# EAGLE design avrsmdprog (EAGLE 5.10)
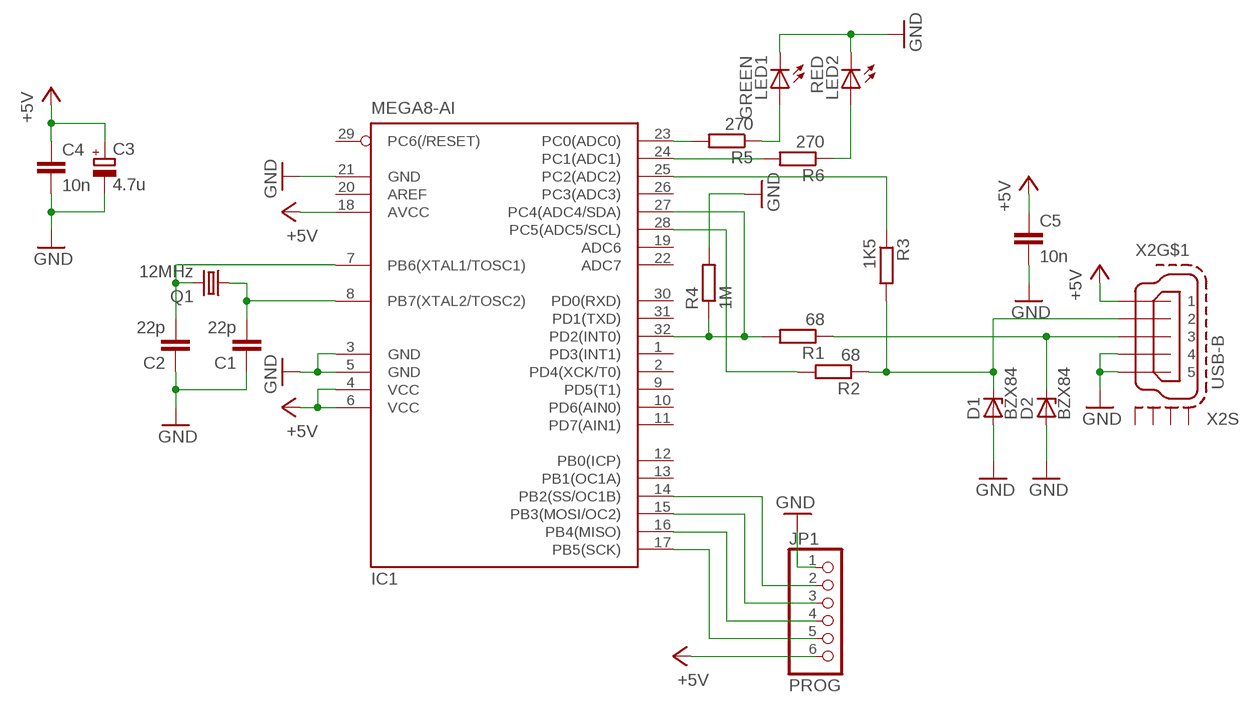
[diagram p0: schematic, sheet 1]

## Parts
C1  22p  C-EUC0805  [C0805]
C2  22p  C-EUC0805  [C0805]
C3  4.7u  CPOL-EU153CLV-0810  [153CLV-0810]
C4  10n  C-EUC0805  [C0805]
C5  10n  C-EUC0805  [C0805]
D1  BZX84  BZX84CSMD  [TO236]
D2  BZX84  BZX84CSMD  [TO236]
IC1  MEGA8-AI  [TQFP32-08]
JP1  PROG  PINHD-1X6/90  [1X06/90]
LED1  GREEN  LEDCHIPLED_0805  [CHIPLED_0805]
LED2  RED  LEDCHIPLED_0805  [CHIPLED_0805]
Q1  12MHz  CRYSTALHC49UP  [HC49UP]
R1  68  R-EU_R0805  [R0805]
R2  68  R-EU_R0805  [R0805]
R3  1K5  R-EU_R0805  [R0805]
R4  1M  R-EU_R0805  [R0805]
R5  270  R-EU_R0805  [R0805]
R6  270  R-EU_R0805  [R0805]
X2  USB-B  MINI-USB-SCHIELD-32005-201  [32005-201]

## Nets
+5V: C3.+ C4.1 C5.1 IC1.4(VCC) IC1.6(VCC) IC1.18(AVCC) JP1.6 X2.1
GND: C1.1 C2.1 C3.- C4.2 C5.2 D1.A D2.A IC1.3(GND) IC1.5(GND) IC1.21(GND) JP1.1 LED1.C LED2.C R4.2 X2.4 X2.5
N$1: C1.2 IC1.8(PB7(XTAL2/TOSC2)) Q1.1
N$2: D2.C R1.1 X2.3
N$3: D1.C R2.1 R3.2 X2.2
N$4: C2.2 IC1.7(PB6(XTAL1/TOSC1)) Q1.2
N$5: IC1.25(PC2(ADC2)) R3.1
N$6: LED2.A R6.1
N$7: IC1.23(PC0(ADC0)) R5.2
N$8: IC1.24(PC1(ADC1)) R6.2
N$9: LED1.A R5.1
N$10: IC1.14(PB2(SS/OC1B)) JP1.2
N$11: IC1.15(PB3(MOSI/OC2)) JP1.3
N$12: IC1.16(PB4(MISO)) JP1.4
N$13: IC1.17(PB5(SCK)) JP1.5
N$14: IC1.28(PC5(ADC5/SCL)) R2.2
N$15: IC1.27(PC4(ADC4/SDA)) IC1.32(PD2(INT0)) R1.2 R4.1
Unconnected: IC1.1(PD3(INT1)) IC1.2(PD4(XCK/T0)) IC1.9(PD5(T1)) IC1.10(PD6(AIN0)) IC1.11(PD7(AIN1)) IC1.12(PB0(ICP)) IC1.13(PB1(OC1A)) IC1.19(ADC6) IC1.20(AREF) IC1.22(ADC7) IC1.26(PC3(ADC3)) IC1.29(PC6(/RESET)) IC1.30(PD0(RXD)) IC1.31(PD1(TXD)) X2.M1(S:S1) X2.M2(S:S2) X2.M3(S:S3) X2.M4(S:S4)

## Library data of the parts
C1 C2 C4 C5 = rcl:C-EU: CAPACITOR, European symbol
C3 = rcl:CPOL-EU: POLARIZED CAPACITOR, European symbol
D1 D2 = diode:BZX84CSMD: Z DIODE
IC1 = atmel:MEGA8: MICROCONTROLLER 8 Kbytes FLASH, 1 kbytes SRAM, 512 bytes EEPROM, USART, 6-channel 10 bit ADC, 2-channel 8 bit ADC Pin compatible with Atmega48, ATMega88, ATMega168 Source: avr.lbr
JP1 = pinhead:PINHD-1X6: PIN HEADER
LED1 LED2 = led:LED: LED OSRAM: - CHIPLED LG R971, LG N971, LY N971, LG Q971, LY Q971, LO R971, LY R971 LH N974, LH R974 LS Q976, LO Q976, LY Q976 LO Q996 - Hyper CHIPLED LW Q18S LB Q993, LB Q99A, LB R99A - SideLED LS A670, LO A670, LY A670, LG A670, LP A670 LB A673, LV A673, LT A673, LW A673 LH A674 LY A675 LS A676, LA A676, LO A676, LY A676, LW A676 LS A679, LY A679, LG A679 - Hyper Micro SIDELED® LS Y876, LA Y876, LO Y876, LY Y876 LT Y87S - SmartLED LW L88C, LW L88S LB L89C, LB L89S, LG L890 LS L89K, LO L89K, LY L89K LS L896, LA L896, LO L896, LY L896 - TOPLED LS T670, LO T670, LY T670, LG T670, LP T670 LSG T670, LSP T670, LSY T670, LOP T670, LYG T670 LG T671, LOG T671, LSG T671 LB T673, LV T673, LT T673, LW T673 LH T674 LS T676, LA T676, LO T676, LY T676, LB T676, LH T676, LSB T676, LW T676 LB T67C, LV T67C, LT T67C, LS T67K, LO T67K, LY T67K, LW E67C LS E67B, LA E67B, LO E67B, LY E67B, LB E67C, LV E67C, LT E67C LW T67C LS T679, LY T679, LG T679 LS T770, LO T770, LY T770, LG T770, LP T770 LB T773, LV T773, LT T773, LW T773 LH T774 LS E675, LA E675, LY E675, LS T675 LS T776, LA T776, LO T776, LY T776, LB T776 LHGB T686 LT T68C, LB T68C - Hyper Mini TOPLED® LB M676 - Mini TOPLED Santana® LG M470 LS M47K, LO M47K, LY M47K Source: http://www.osram.convergy.de LUXEON: - LUMILED® LXK2-PW12-R00, LXK2-PW12-S00, LXK2-PW14-U00, LXK2-PW14-V00 LXK2-PM12-R00, LXK2-PM12-S00, LXK2-PM14-U00 LXK2-PE12-Q00, LXK2-PE12-R00, LXK2-PE12-S00, LXK2-PE14-T00, LXK2-PE14-U00 LXK2-PB12-K00, LXK2-PB12-L00, LXK2-PB12-M00, LXK2-PB14-N00, LXK2-PB14-P00, LXK2-PB14-Q00 LXK2-PR12-L00, LXK2-PR12-M00, LXK2-PR14-Q00, LXK2-PR14-R00 LXK2-PD12-Q00, LXK2-PD12-R00, LXK2-PD12-S00 LXK2-PH12-R00, LXK2-PH12-S00 LXK2-PL12-P00, LXK2-PL12-Q00, LXK2-PL12-R00 Source: www.luxeon.com KINGBRIGHT: KA-3528ASYC Source: www.kingbright.com
Q1 = crystal:CRYSTAL: CRYSTAL
R1-R6 = rcl:R-EU_: RESISTOR, European symbol
X2 = con-cypressindustries:MINI-USB-SCHIELD-: MINI USB-B Conector Source: www.cypressindustries.com

## Board
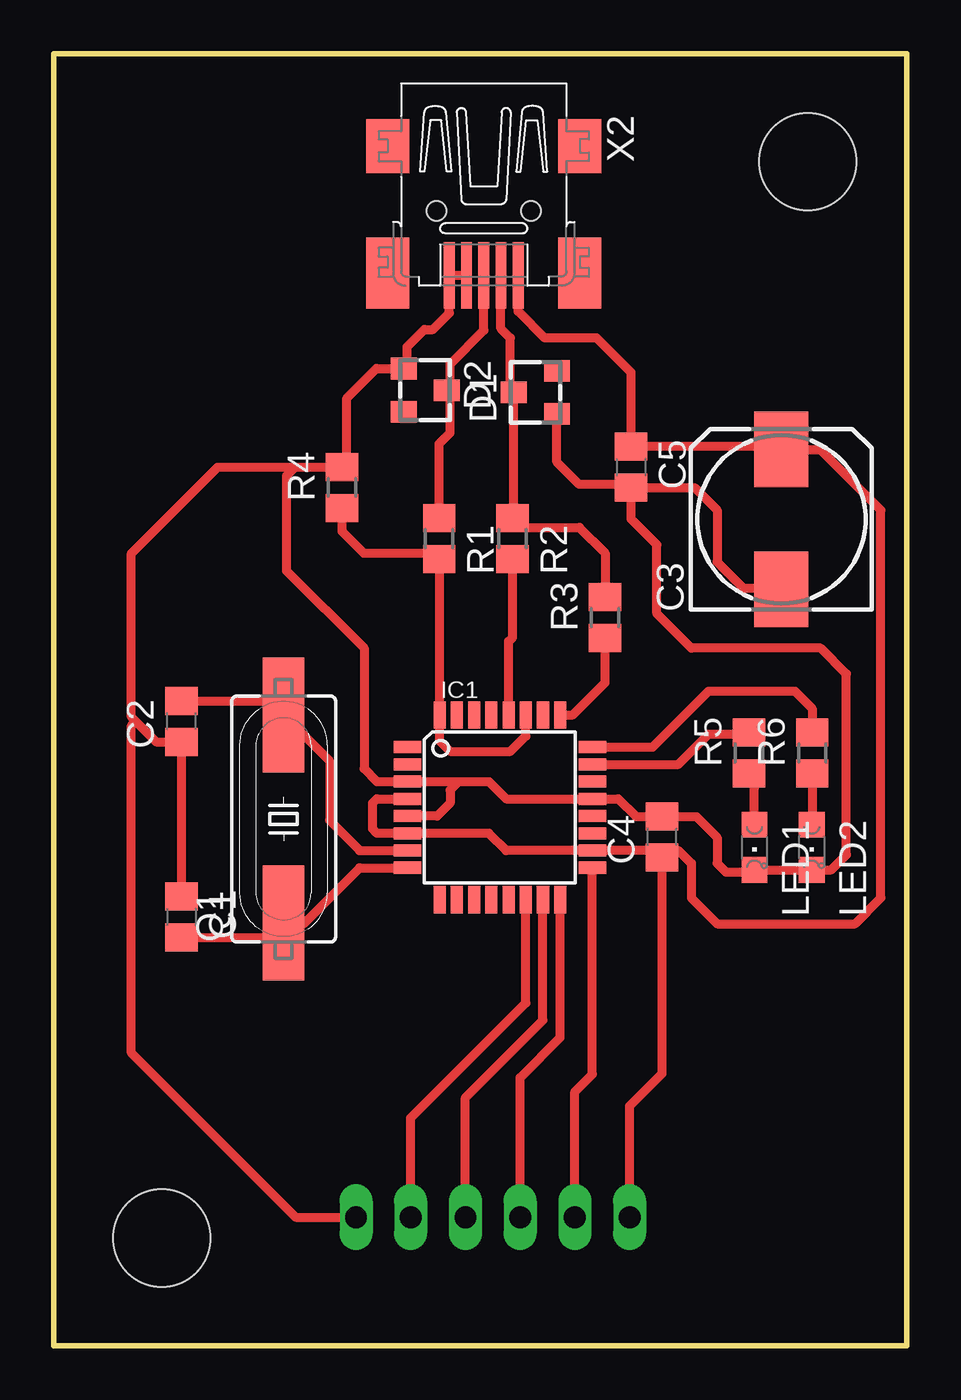
[diagram p1: board, top side]
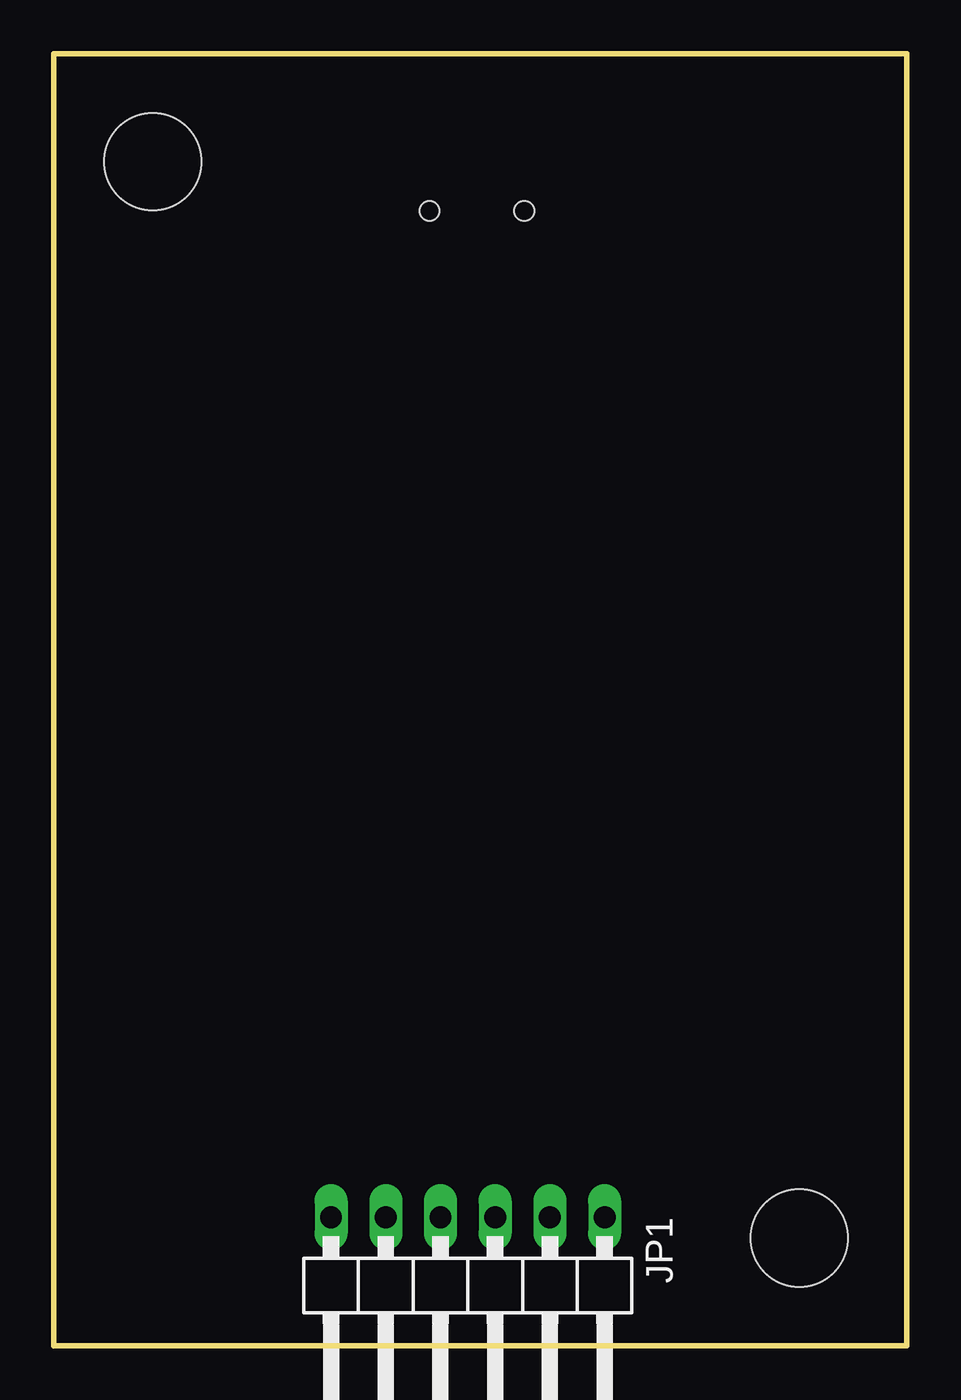
[diagram p2: board, bottom side, seen from below]

Size 39.6 x 60 mm. Coordinates in mm from the lower left corner, seen from the top.
Outline: 0,0 39.6,0 39.6,60 0,60 0,0
Copper layers (1*16): Top 0.035mm / dielectric 1.5mm / Bottom 0.035mm
Design rules "default": minimum track width 10mil, minimum drill 24mil, track to track 8mil, track to pad 8mil, pad to pad 8mil, via to via 8mil, smd to smd 8mil, copper to edge 40mil, drill to drill 8mil, minimum pad ring 10mil, minimum via ring 8mil, stop-mask expansion 4mil, vias tented up to drill 0mil, thermal gap 10mil
Holes 4.5 mm at 5,5 35,55

### Footprints (pad centres in the part's own frame; a part is rotated, then mirrored left to right if it is on the bottom)
C0805 = smd 1.3 x 1.5: 1 -0.95,0; 2 0.95,0
153CLV-0810 = smd 3.5 x 2.5: + 3.25,0; - -3.25,0
TO236 = smd 1 x 1.2: A -1,-1; C 0,1; NC 1,-1
TQFP32-08 = smd 1.27 x 0.559: 1 -4.293,2.8; 2 -4.293,2; 3 -4.293,1.2; 4 -4.293,0.4; 5 -4.293,-0.4; 6 -4.293,-1.2; 7 -4.293,-2; 8 -4.293,-2.8; 17 4.293,-2.8; 18 4.293,-2; 19 4.293,-1.2; 20 4.293,-0.4; 21 4.293,0.4; 22 4.293,1.2; 23 4.293,2; 24 4.293,2.8 | smd 0.559 x 1.27: 9 -2.8,-4.293; 10 -2,-4.293; 11 -1.2,-4.293; 12 -0.4,-4.293; 13 0.4,-4.293; 14 1.2,-4.293; 15 2,-4.293; 16 2.8,-4.293; 25 2.8,4.293; 26 2,4.293; 27 1.2,4.293; 28 0.4,4.293; 29 -0.4,4.293; 30 -1.2,4.293; 31 -2,4.293; 32 -2.8,4.293
1X06/90 = drill 1.016 long: 1 -6.35,-3.81; 2 -3.81,-3.81; 3 -1.27,-3.81; 4 1.27,-3.81; 5 3.81,-3.81; 6 6.35,-3.81
CHIPLED_0805 = smd 1.2 x 1.2: A 0,-1.05; C 0,1.05
HC49UP = smd 5.334 x 1.93: 1 -4.826,0; 2 4.826,0
R0805 = smd 1.3 x 1.5: 1 -0.95,0; 2 0.95,0
32005-201 = smd 3.1 x 0.5: 1 3,1.6; 2 3,0.8; 3 3,0; 4 3,-0.8; 5 3,-1.6 | smd 2.5 x 2: M1 -3,-4.45; M2 -3,4.45 | smd 3.3 x 2: M3 2.9,4.45; M4 2.9,-4.45 | hole 0.9: 0,2.2; 0,-2.2

### Placement (x,y rotation side)
C1  5.92,19.92 270 top
C2  5.92,29 90 top
C3  33.78,38.38 90 top
C4  28.24,23.62 90 top
C5  26.8,40.8 270 top
D1  22.36,44.27 90 top
D2  17.24,44.38 270 top
IC1  20.71,25 0 top
JP1  20.38,2.16 180 bottom
LED1  32.53,23.15 180 top
LED2  35.19,23.15 180 top
Q1  10.67,24.46 90 top
R1  17.89,37.49 270 top
R2  21.3,37.49 270 top
R3  25.59,33.82 90 top
R4  13.38,39.86 90 top
R5  32.27,27.53 90 top
R6  35.21,27.53 90 top
X2  19.96,52.71 270 top

### Tracks (layer width: path | path; a pad name or v marks a point on that pad's centre or on a via)
+5V
  Top 0.406: X2.1 21.56,48.04 22.8,46.8 25.2,46.8 26.8,45.2 C5.1 33.66,41.75 C3.+ 33.81,41.6 35.6,41.6 38.4,38.8 38.4,20.8 37.2,19.6 30.8,19.6 29.6,20.8 29.6,22.4 29,23 27.91,23 | IC1.4 15,25.4 14.8,25.2 14.8,24 15,23.8 IC1.6 20.2,23.8 21,23 IC1.18 27.91,23 | 27.91,23 C4.1 28.24,12.64 26.73,11.13 JP1.6
GND
  Top 0.406: 26.4,40 26.65,40 C5.2 29.75,39.85 30.8,38.8 30.8,36.4 32,35.2 33.85,35.2 | 33.85,35.2 34.4,35.2 | 33.85,35.2 C3.- | X2.4 X2.5 18.36,47.96 17.6,47.2 17.2,47.2 16.4,46.4 16.4,45.54 D2.A 14.98,45.38 13.6,44 13.6,41.03 R4.2 11.2,40.8 | 18.8,26.2 IC1.3 15,26.2 14.4,26.8 14.4,32.4 10.8,36 10.8,40.4 11.2,40.8 | 18.8,26.2 20.2,26.2 21,25.4 IC1.21 26.2,25.4 27.03,24.57 C4.2 29.83,24.57 30.8,23.6 30.8,22.4 31.2,22 32.43,22 LED1.C LED2.C 36.1,22.1 36.8,22.8 36.8,31.2 35.6,32.4 29.6,32.4 28,34 28,37.2 26.8,38.4 26.8,39.6 26.4,40 | C1.1 C2.1 4.75,28.05 3.8,29 | 3.8,29 3.6,29.2 3.6,36.8 7.6,40.8 11.2,40.8 | JP1.1 11.23,5.97 3.6,13.6 3.6,28.8 3.8,29 | IC1.5 17.8,24.6 18.4,25.2 18.4,25.8 18.8,26.2 | D1.A 23.36,41.04 24.4,40 26.4,40
N$1
  Top 0.406: C1.2 10.01,18.97 Q1.1 10.7,19.6 11.6,19.6 14.2,22.2 IC1.8
N$2
  Top 0.406: R1.1 17.89,41.89 18.4,42.4 18.4,44.22 D2.C 18.4,44.54 18.4,45.6 19.96,47.16 X2.3
N$3
  Top 0.406: X2.2 20.76,47.24 21.2,46.8 21.2,44.43 D1.C 21.36,38.5 R2.1 21.74,38 24.4,38 25.59,36.81 R3.2
N$4
  Top 0.406: C2.2 10.01,29.95 Q1.2 12.8,27.16 12.8,24.4 14.2,23 IC1.7
N$5
  Top 0.406: IC1.25 24.09,29.29 25.6,30.8 R3.1
N$6
  Top 0.406: R6.1 35.21,24.22 LED2.A
N$7
  Top 0.406: IC1.23 29,27 30.4,28.4 32.19,28.4 R5.2
N$8
  Top 0.406: R6.2 35.21,29.59 34.4,30.4 30.4,30.4 27.8,27.8 IC1.24
N$9
  Top 0.406: LED1.A 32.53,25.92 R5.1
N$10
  Top 0.406: IC1.14 21.91,15.91 16.57,10.57 JP1.2
N$11
  Top 0.406: IC1.15 22.71,15.11 19.11,11.51 JP1.3
N$12
  Top 0.406: IC1.16 23.51,14.31 21.65,12.45 JP1.4
N$13
  Top 0.406: IC1.17 25,12.6 24.19,11.79 JP1.5
N$14
  Top 0.406: IC1.28 21.11,32.71 21.3,32.9 R2.2
N$15
  Top 0.406: R4.1 13.38,37.82 14.4,36.8 17.63,36.8 R1.2 17.91,36.52 IC1.32 17.91,28.09 18.4,27.6 21.2,27.6 21.91,28.31 IC1.27